# EAGLE design WallE 2.0 (EAGLE 7.2.0)
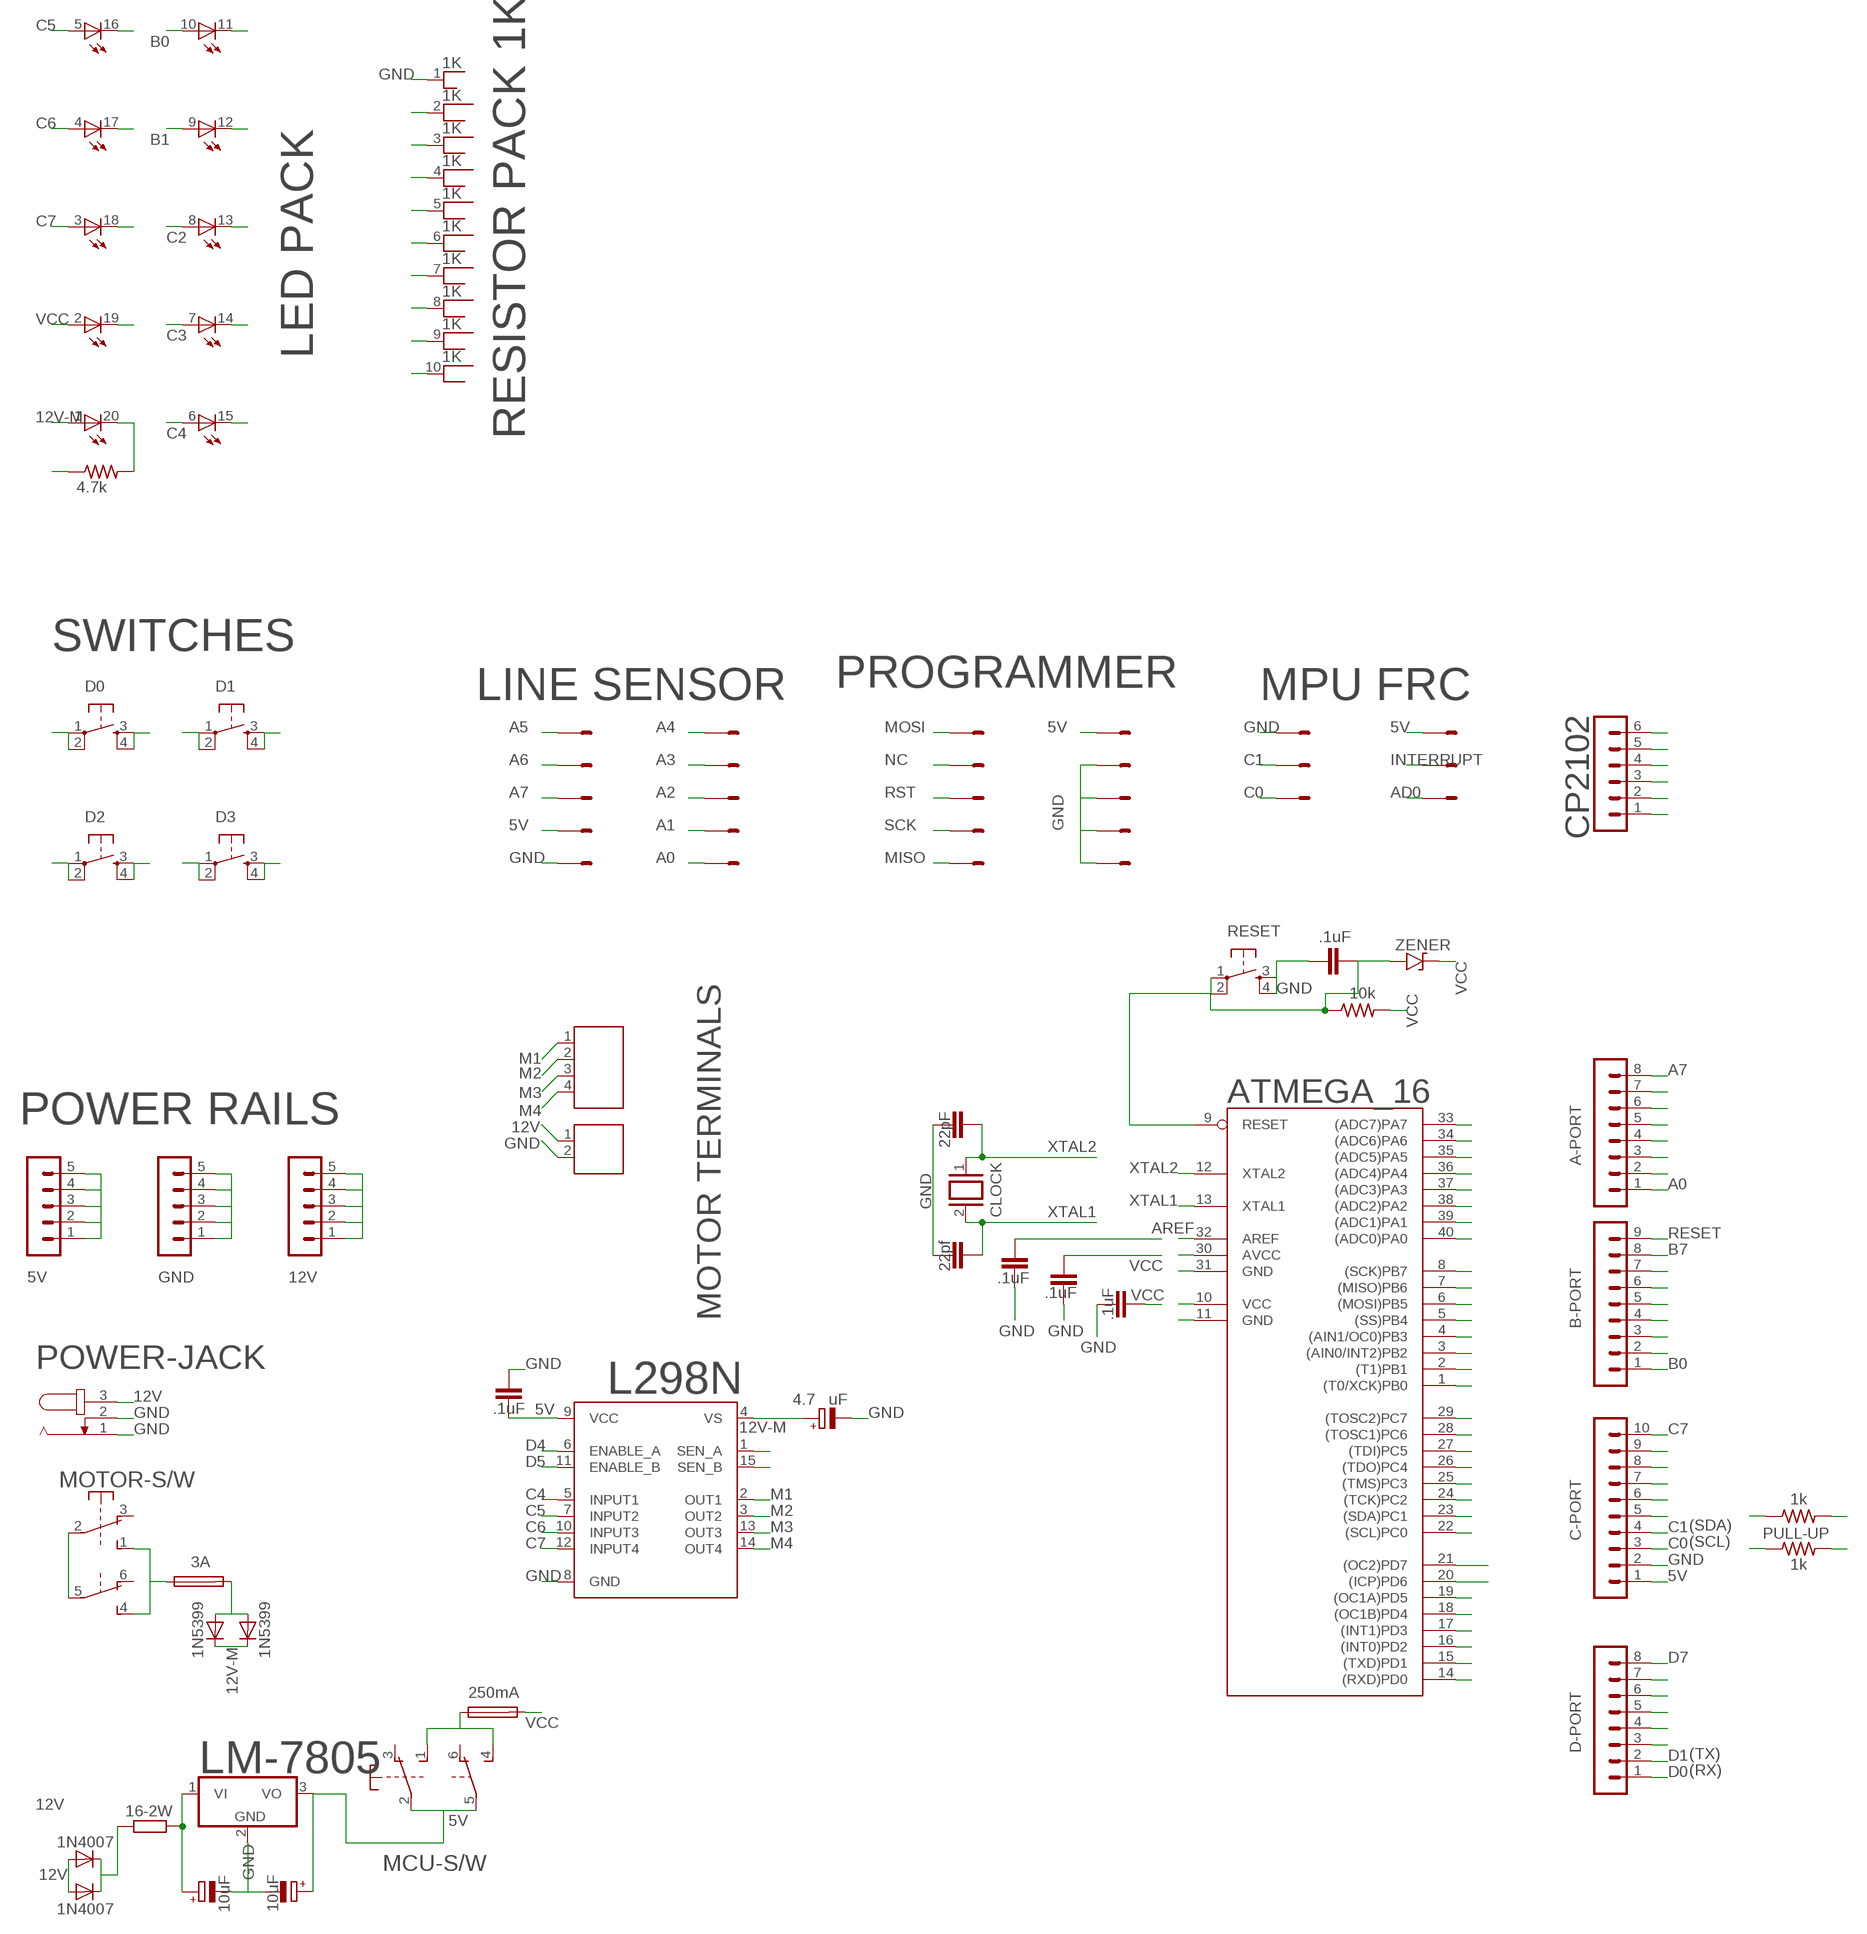
[diagram p0: schematic, sheet 1]

## Parts
5V  MA05-1  [MA05-1]
12V  MA05-1  [MA05-1]
16-2W  R-EU_0617/17  [0617/17]
A-PORT  MA08-1  [MA08-1]
ATMEGA_16  MEGA32-P  [DIL40]
B-PORT  MA09-1  [MA09-1]
C1  10uF  CPOL-EUE2.5-6  [E2,5-6]
C2  .1uF  C5/2.5  [C5B2.5]
C3  22pf  C2.5/2  [C2.5-2]
C4  22pF  C2.5/2  [C2.5-2]
C5  .1uF  C5/2.5  [C5B2.5]
C6  .1uF  C5/2.5  [C5B2.5]
C7  .1uF  C5/2.5  [C5B2.5]
C8  4.7 uF  CPOL-EUE2.5-6  [E2,5-6]
C9  .1uF  C5/2.5  [C5B2.5]
C10  10uF  CPOL-EUE2.5-6  [E2,5-6]
C-PORT  MA10-1  [MA10-1]
CLOCK  XTAL/S  [QS]
CP2102  MA06-1  [MA06-1]
D0  DTS-6  [DTS-6]
D1  DTS-6  [DTS-6]
D2  DTS-6  [DTS-6]
D3  DTS-6  [DTS-6]
D4  1N4007  DIODE-D-7.5  [D-7.5]
D5  1N4007  DIODE-D-7.5  [D-7.5]
D6  1N5399  DIODE-DO15-12  [DO15-12]
D7  1N5399  DIODE-DO15-12  [DO15-12]
D-PORT  MA08-1  [MA08-1]
DZ1  LB10  [LB10]
F1  3A  SH25  [SH25]
F2  250mA  SH25  [SH25]
GND  MA05-1  [MA05-1]
J1  691131710004  [691131710004]
J2  691131710002  [691131710002]
L298N  L298  [MULTIWATT-15]
LINE-SENSOR  057-010-1  [057-010-1]
LM-7805  786TV  [TO220V]
MCU-S/W  9077-2  [9077-2]
MOTOR-S/W  9077-2  [9077-2]
MPU-6050  057-006-1  [057-006-1]
POWER-JACK  JACK-PLUG1  [SPC4078]
R2  4.7k  R-US_0207/7  [0207/7]
R3  10k  R-US_0207/7  [0207/7]
R5  1k  R-US_0207/7  [0207/7]
R6  1k  R-US_0207/7  [0207/7]
RESET  DTS-6  [DTS-6]
RN1  1K  RNX9  [RN-10]
X2  PROGRAMMER  057-010-1  [057-010-1]
ZENER  ZENER  1N9ZENER2  [DO35-2]

## Nets
3.3V: CP2102.1
5V: 5V.1 5V.2 5V.3 5V.4 5V.5 C9.1 C10.+ C-PORT.1 CP2102.6 L298N.9(VCC) LINE-SENSOR.7 LM-7805.3(VO) MCU-S/W.2(1:P) MCU-S/W.5(2:P) MPU-6050.2 R5.2 R6.2 X2.2
12V: 12V.1 12V.2 12V.3 12V.4 12V.5 D4.A D5.A J2.1 MOTOR-S/W.2(1:P) MOTOR-S/W.5(2:P) POWER-JACK.3
12V-M: C8.+ D6.C D7.C DZ1.1(-1:A) L298N.4(VS)
A0: A-PORT.1 ATMEGA_16.40((ADC0)PA0) LINE-SENSOR.10
A1: A-PORT.2 ATMEGA_16.39((ADC1)PA1) LINE-SENSOR.8
A2: A-PORT.3 ATMEGA_16.38((ADC2)PA2) LINE-SENSOR.6
A3: A-PORT.4 ATMEGA_16.37((ADC3)PA3) LINE-SENSOR.4
A4: A-PORT.5 ATMEGA_16.36((ADC4)PA4) LINE-SENSOR.2
A5: A-PORT.6 ATMEGA_16.35((ADC5)PA5) LINE-SENSOR.1
A6: A-PORT.7 ATMEGA_16.34((ADC6)PA6) LINE-SENSOR.3
A7: A-PORT.8 ATMEGA_16.33((ADC7)PA7) LINE-SENSOR.5
AREF: ATMEGA_16.32(AREF) C7.1
B0: ATMEGA_16.1((T0/XCK)PB0) B-PORT.1 DZ1.10(-10:A)
B0R: DZ1.11(-10:C) RN1.10
B1: ATMEGA_16.2((T1)PB1) B-PORT.2 DZ1.9(-9:A)
B1R: DZ1.12(-9:C) RN1.9
B2: ATMEGA_16.3((AIN0/INT2)PB2) B-PORT.3
B3: ATMEGA_16.4((AIN1/OC0)PB3) B-PORT.4
B4: ATMEGA_16.5((SS)PB4) B-PORT.5
B5: ATMEGA_16.6((MOSI)PB5) B-PORT.6 X2.1
B6: ATMEGA_16.7((MISO)PB6) B-PORT.7 X2.9
B7: ATMEGA_16.8((SCK)PB7) B-PORT.8 X2.7
C0: ATMEGA_16.22((SCL)PC0) C-PORT.3 MPU-6050.5 R6.1
C1: ATMEGA_16.23((SDA)PC1) C-PORT.4 MPU-6050.3 R5.1
C2: ATMEGA_16.24((TCK)PC2) C-PORT.5 DZ1.8(-8:A)
C2R: DZ1.13(-8:C) RN1.8
C3: ATMEGA_16.25((TMS)PC3) C-PORT.6 DZ1.7(-7:A)
C3R: DZ1.14(-7:C) RN1.7
C4: ATMEGA_16.26((TDO)PC4) C-PORT.7 DZ1.6(-6:A) L298N.5(INPUT1)
C4R: DZ1.15(-6:C) RN1.6
C5: ATMEGA_16.27((TDI)PC5) C-PORT.8 DZ1.5(-5:A) L298N.7(INPUT2)
C5R: DZ1.16(-5:C) RN1.5
C6: ATMEGA_16.28((TOSC1)PC6) C-PORT.9 DZ1.4(-4:A) L298N.10(INPUT3)
C6R: DZ1.17(-4:C) RN1.4
C7: ATMEGA_16.29((TOSC2)PC7) C-PORT.10 DZ1.3(-3:A) L298N.12(INPUT4)
C7R: DZ1.18(-3:C) RN1.3
D0: ATMEGA_16.14((RXD)PD0) CP2102.3 D0.1 D0.2 D-PORT.1
D1: ATMEGA_16.15((TXD)PD1) CP2102.4 D1.1 D1.2 D-PORT.2
D2: ATMEGA_16.16((INT0)PD2) D2.1 D2.2 D-PORT.3
D3: ATMEGA_16.17((INT1)PD3) D3.1 D3.2 D-PORT.4
D4: ATMEGA_16.18((OC1B)PD4) D-PORT.5 L298N.6(ENABLE_A)
D5: ATMEGA_16.19((OC1A)PD5) D-PORT.6 L298N.11(ENABLE_B)
D6: ATMEGA_16.20((ICP)PD6) D-PORT.7
D7: ATMEGA_16.21((OC2)PD7) D-PORT.8
DTR: CP2102.2
GND: ATMEGA_16.11(GND) ATMEGA_16.31(GND) C1.- C2.2 C3.2 C4.2 C5.2 C6.2 C7.2 C8.- C9.2 C10.- C-PORT.2 CP2102.5 D0.3 D0.4 D1.3 D1.4 D2.3 D2.4 D3.3 D3.4 GND.1 GND.2 GND.3 GND.4 GND.5 J2.2 L298N.1(SEN_A) L298N.8(GND) L298N.15(SEN_B) LINE-SENSOR.9 LM-7805.2(GND) MPU-6050.1 MPU-6050.6 POWER-JACK.1 POWER-JACK.2 R2.1 RESET.3 RESET.4 RN1.1 X2.4 X2.6 X2.8 X2.10
INTERRUPT: MPU-6050.4
M1: J1.1 L298N.2(OUT1)
M2: J1.2 L298N.3(OUT2)
M3: J1.3 L298N.13(OUT3)
M4: J1.4 L298N.14(OUT4)
N$1: DZ1.20(-1:C) R2.2
N$2: 16-2W.2 C1.+ LM-7805.1(VI)
N$3: F1.1 MOTOR-S/W.1(1:S) MOTOR-S/W.4(2:S)
N$6: F2.1 MCU-S/W.1(1:S) MCU-S/W.4(2:S)
N$8: 16-2W.1 D4.C D5.C
N$9: D6.A D7.A F1.2
N$10: X2.3
RESET: ATMEGA_16.9(RESET) B-PORT.9 C5.1 R3.1 RESET.1 RESET.2 X2.5 ZENER.A
VCC: ATMEGA_16.10(VCC) ATMEGA_16.30(AVCC) C2.1 C6.1 DZ1.2(-2:A) F2.2 R3.2 ZENER.C
VCCR: DZ1.19(-2:C) RN1.2
XTAL1: ATMEGA_16.13(XTAL1) C3.1 CLOCK.2
XTAL2: ATMEGA_16.12(XTAL2) C4.1 CLOCK.1
Unconnected: MCU-S/W.3(1:O) MCU-S/W.6(2:O) MOTOR-S/W.3(1:O) MOTOR-S/W.6(2:O)

## Notes on the sheet
- LED PACK
- RESISTOR PACK 1K
- SWITCHES
- LINE SENSOR
- MPU FRC
- MOSI | 5V
- NC
- RST | AD0
- SCK | GND
- MISO
- POWER RAILS
- MOTOR TERMINALS
- (SDA)
- PULL-UP
- (SCL)
- (TX)
- (RX)

## Library data of the parts
5V 12V GND = con-lstb:MA05-1: PIN HEADER; OC_FARNELL: unknown; OC_NEWARK: unknown
16-2W = resistor:R-EU_: RESISTOR, European symbol
A-PORT D-PORT = con-lstb:MA08-1: PIN HEADER; OC_FARNELL: unknown; OC_NEWARK: unknown
ATMEGA_16 = atmel:MEGA32-P: MICROCONTROLLER 32 Kbytes FLASH 2 Kbytes SRAM 1 Kbytes EEPROM USART 8-channel 10 bit ADC Source: www.atmel.com .. doc2503.pdf; MPN: ATMEGA32-16PU; OC_FARNELL: 1661729; OC_NEWARK: 51P1794
B-PORT = con-lstb:MA09-1: PIN HEADER; OC_FARNELL: unknown; OC_NEWARK: unknown
C1 C8 C10 = rcl:CPOL-EU: POLARIZED CAPACITOR, European symbol
C2-C7 C9 = capacitor-wima:C: CAPACITOR naming: grid - package width
C-PORT = con-lstb:MA10-1: PIN HEADER; OC_FARNELL: unknown; OC_NEWARK: unknown
CLOCK = special:XTAL/S: CRYSTAL
CP2102 = con-lstb:MA06-1: PIN HEADER; OC_FARNELL: unknown; OC_NEWARK: unknown
D0 D1-D3 RESET = switch-tact:DTS-6
D4-D7 = diode:DIODE-: DIODE
DZ1 = led:LB10: LED BLOCK 10-LED bar graph, DIL, Siemens
F1 F2 = fuse:SH25: FUSE HOLDER grid 25 mm, OGN0031 8211, Schurter (Buerklin); MF: SCHURTER; MPN: 0031.8211; OC_FARNELL: 1162741; OC_NEWARK: 96B9380
J1 = Wurth_Elektronik_Electromechanic_Terminal_Blocks_Connectors_rev16b:691131710004: WR-TBL Terminal block - CUU5/4 - 4 Pins;=>Code : Con_TBL_Screw_PClamp_5.00_6911317100xx_691131710004 <http://katalog.we-online.de/media/images/eican/Con_TBL_Screw_PClamp_5.00_6911317100xx_pf2.jpg> Details see: http://katalog.we-online.de/em/datasheet/6911317100xx.pdf Created 11/3/2014, Karrer Zheng 2014 (C) Wurth Elektronik
J2 = Wurth_Elektronik_Electromechanic_Terminal_Blocks_Connectors_rev16b:691131710002: WR-TBL Terminal block - CUU5/2 CUU5/2GR - 2 Pins;=>Code : Con_TBL_Screw_PClamp_5.00_6911317100xx_691131710002 <http://katalog.we-online.de/media/images/eican/Con_TBL_Screw_PClamp_5.00_6911317100xx_pf2.jpg> Details see: http://katalog.we-online.de/em/datasheet/6911317100xx.pdf Created 11/23/2014, Karrer Zheng 2014 (C) Wurth Elektronik
L298N = st-microelectronics:L298: DUAL FULL-BRIDGE DRIVER; MPN: L298N; OC_FARNELL: 1589425; OC_NEWARK: 32M1527
LINE-SENSOR X2 = con-panduit:057-010-: CONNECTOR 10-pin series 057 contact pc board low profile headers; OC_FARNELL: unknown; OC_NEWARK: unknown
LM-7805 = linear:78*: Positive VOLTAGE REGULATOR Source: http://cache.national.com/ds/LM/LM78L05.pdf http://www.fairchildsemi.com/ds/LM/LM7805.pdf
MCU-S/W MOTOR-S/W = switch-misc:9077-2: MARQUARDT SWITCH 9077.0200 Distributor: Buerklin <https://www.buerklin.com/default.asp?event=ShowArtikel%2812G2822%29&l=d&jump=ArtNr_12G2822>
MPU-6050 = con-panduit:057-006-: CONNECTOR 6-pin series 057 contact pc board low profile headers; OC_FARNELL: unknown; OC_NEWARK: unknown
POWER-JACK = con-jack:JACK-PLUG: DC POWER JACK Power Jack, DC, Right Angle, Through Hole, Rated 5A at 16VDC, PC Terminals Distributor: Farnell (www.Farnell.de) Drawing: 84N1161.pdf / 84N1162.pdf Manufacturer: SPC Technology (www.spctechnology.com) Type: SPC4077 / SPC 4078; OC_FARNELL: unknown; OC_NEWARK: unknown
R2 R3 R5 R6 = resistor:R-US_: RESISTOR, American symbol
RN1 = resistor-net:RNX9: RESISTOR NETWORK; OC_FARNELL: unknown; OC_NEWARK: unknown
ZENER = gm-diodes:1N9*ZENER: 1N9???B Zener Diode DO-35 case 1N957B - 1N992B (6.8V to 200V)

## Net classes
0 default: clearance 0.205 mm

## Board
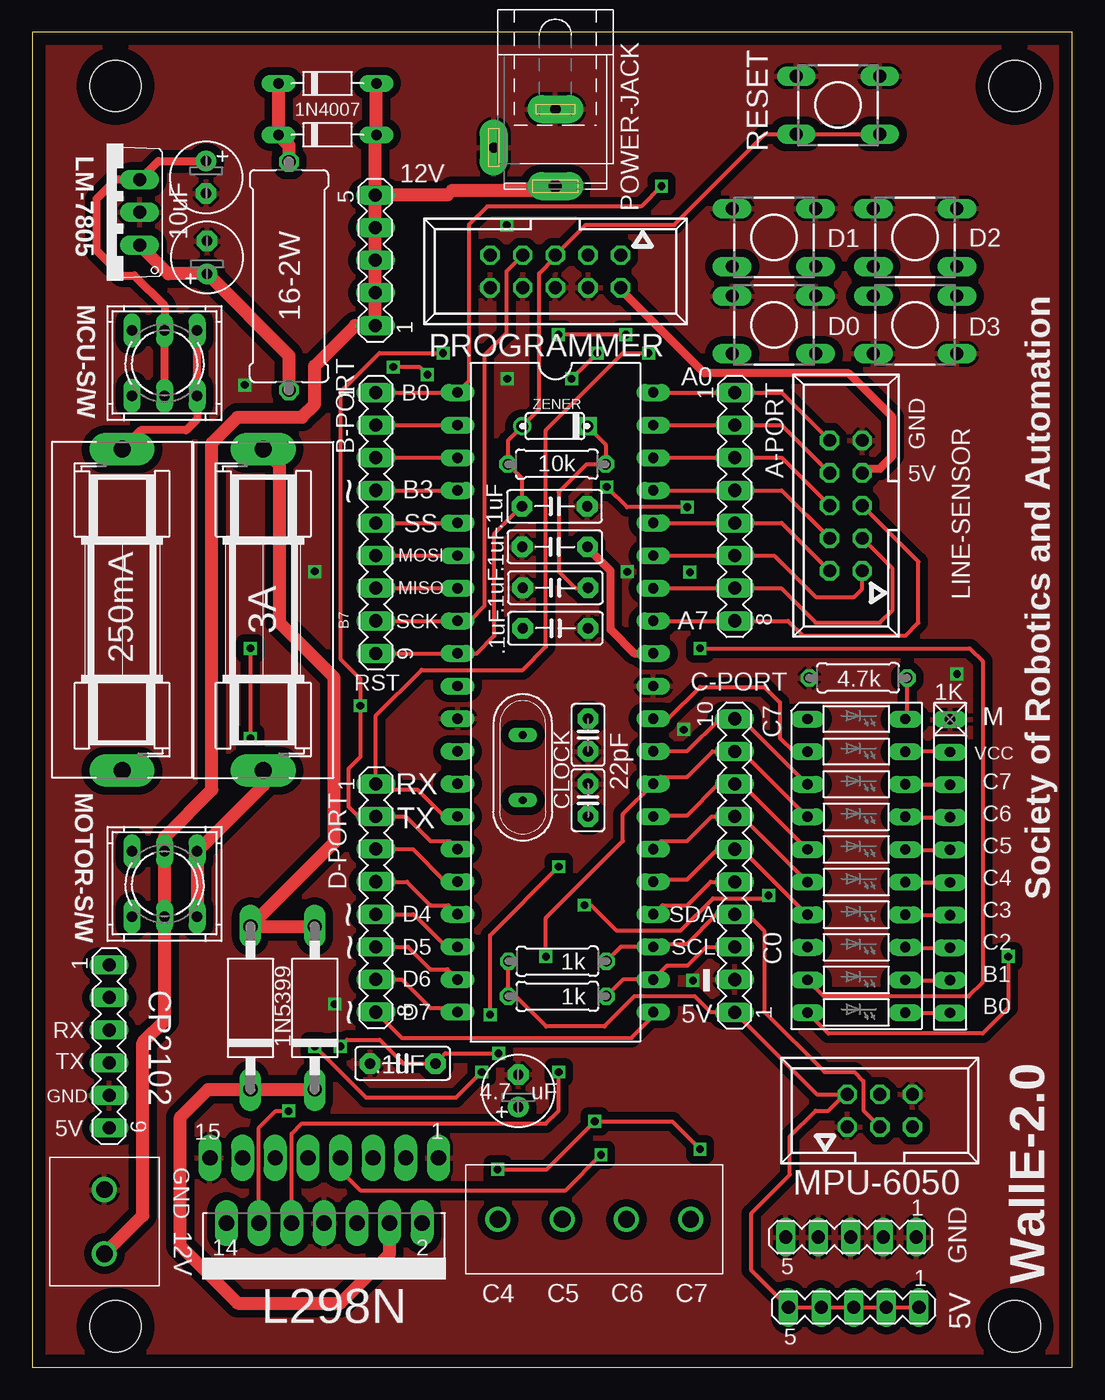
[diagram p1: board, top side]
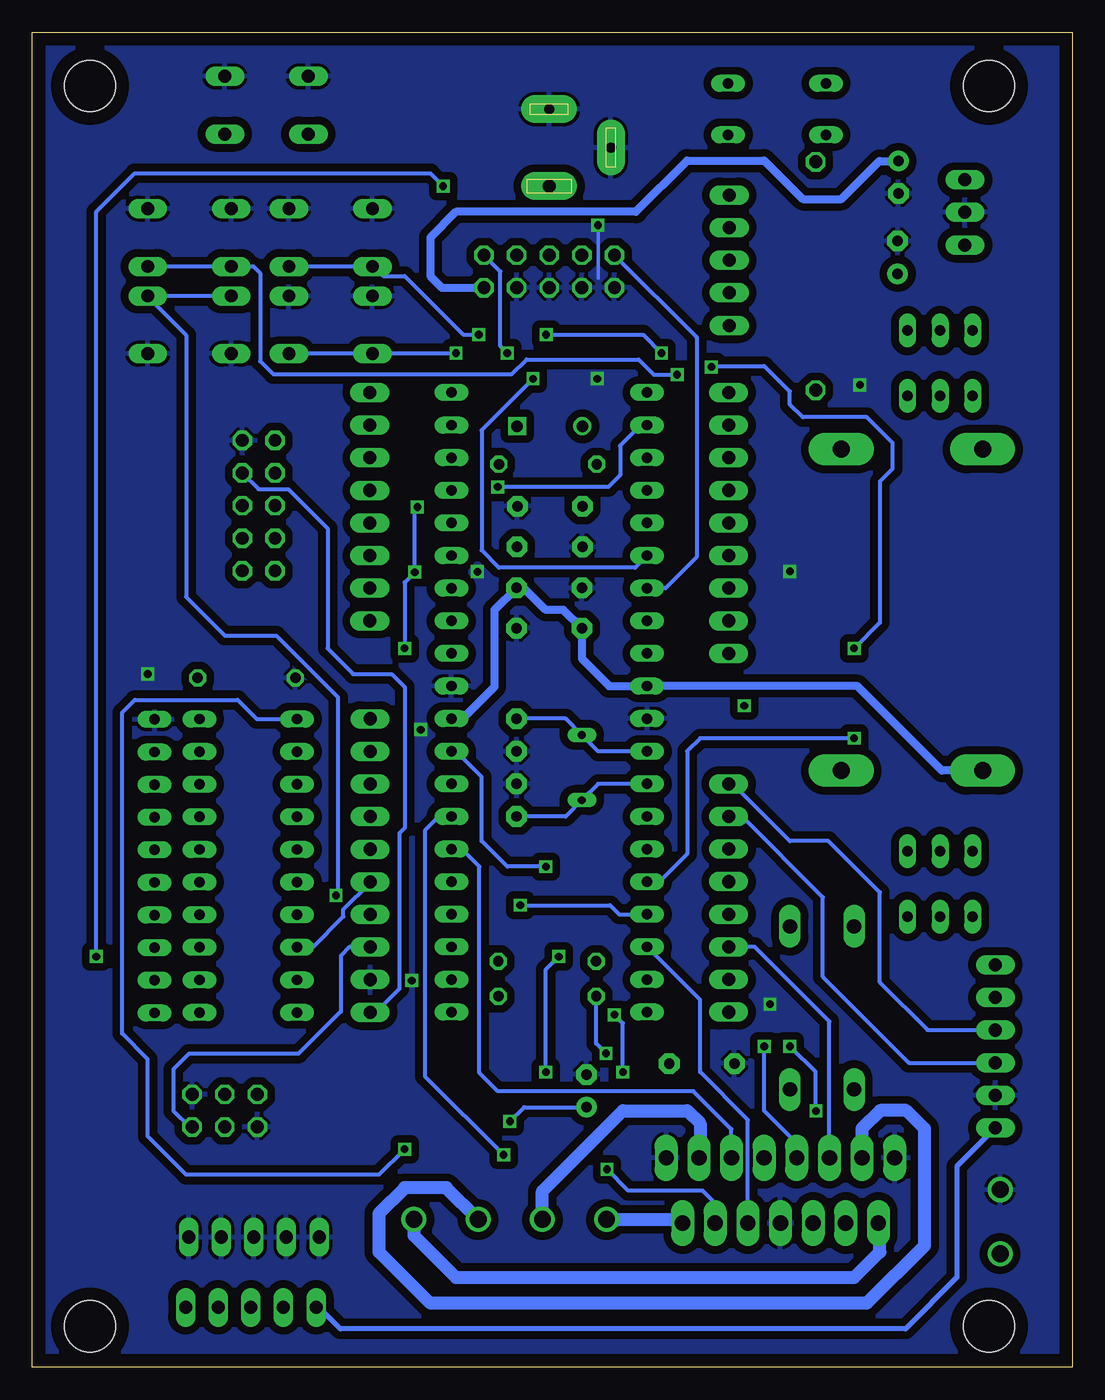
[diagram p2: board, bottom side, seen from below]

Size 81 x 104 mm. Coordinates in mm from the lower left corner, seen from the top.
Outline: 0,0 81,0 81,104 0,104 0,0
Copper layers (1*16): Top 0.035mm / dielectric 1.5mm / Bottom 0.035mm
Design rules "default *": minimum track width 10mil, minimum drill 24mil, track to track 9mil, track to pad 9mil, pad to pad 9mil, via to via 9mil, smd to smd 8mil, copper to edge 40mil, drill to drill 8mil, minimum pad ring 10mil, minimum via ring 8mil, stop-mask expansion 4mil, vias tented up to drill 0mil, thermal gap 10mil
Holes 4 mm at 6.5,3.2 6.5,99.8 76.5,99.8 76.5,3.2

### Footprints (pad centres in the part's own frame; a part is rotated, then mirrored left to right if it is on the bottom)
MA05-1 = drill 1.016 long: 1 -5.08,0; 2 -2.54,0; 3 0,0; 4 2.54,0; 5 5.08,0
0617/17 = drill 1.016 octagon: 1 -8.89,0; 2 8.89,0
MA08-1 = drill 1.016 long: 1 -8.89,0; 2 -6.35,0; 3 -3.81,0; 4 -1.27,0; 5 1.27,0; 6 3.81,0; 7 6.35,0; 8 8.89,0
DIL40 = drill 0.813 long: 1 -24.13,-7.62; 2 -21.59,-7.62; 3 -19.05,-7.62; 4 -16.51,-7.62; 5 -13.97,-7.62; 6 -11.43,-7.62; 7 -8.89,-7.62; 8 -6.35,-7.62; 9 -3.81,-7.62; 10 -1.27,-7.62; 11 1.27,-7.62; 12 3.81,-7.62; 13 6.35,-7.62; 14 8.89,-7.62; 15 11.43,-7.62; 16 13.97,-7.62; 17 16.51,-7.62; 18 19.05,-7.62; 19 21.59,-7.62; 20 24.13,-7.62; 21 24.13,7.62; 22 21.59,7.62; 23 19.05,7.62; 24 16.51,7.62; 25 13.97,7.62; 26 11.43,7.62; 27 8.89,7.62; 28 6.35,7.62; 29 3.81,7.62; 30 1.27,7.62; 31 -1.27,7.62; 32 -3.81,7.62; 33 -6.35,7.62; 34 -8.89,7.62; 35 -11.43,7.62; 36 -13.97,7.62; 37 -16.51,7.62; 38 -19.05,7.62; 39 -21.59,7.62; 40 -24.13,7.62
MA09-1 = drill 1.016 long: 1 -10.16,0; 2 -7.62,0; 3 -5.08,0; 4 -2.54,0; 5 0,0; 6 2.54,0; 7 5.08,0; 8 7.62,0; 9 10.16,0
E2,5-6 = drill 0.813 pad 1.6: + -1.27,0 | drill 0.813 pad 1.6 octagon: - 1.27,0
C5B2.5 = drill 0.813 pad 1.6 octagon: 1 -2.54,0; 2 2.54,0
C2.5-2 = drill 0.813 pad 1.6 octagon: 1 -1.27,0; 2 1.27,0
MA10-1 = drill 1.016 long: 1 -11.43,0; 2 -8.89,0; 3 -6.35,0; 4 -3.81,0; 5 -1.27,0; 6 1.27,0; 7 3.81,0; 8 6.35,0; 9 8.89,0; 10 11.43,0
QS = drill 0.61 long: 1 -2.54,0; 2 2.54,0
MA06-1 = drill 1.016 long: 1 -6.35,0; 2 -3.81,0; 3 -1.27,0; 4 1.27,0; 5 3.81,0; 6 6.35,0
DTS-6 = drill 1 long: 1 -3.25,2.25; 2 3.25,2.25; 3 -3.25,-2.25; 4 3.25,-2.25
D-7.5 = drill 0.813 long: A 3.81,0; C -3.81,0
DO15-12 = drill 1.118 long: A 6.35,0; C -6.35,0
LB10 = drill 0.813 long: 1 -11.43,-3.81; 2 -8.89,-3.81; 3 -6.35,-3.81; 4 -3.81,-3.81; 5 -1.27,-3.81; 6 1.27,-3.81; 7 3.81,-3.81; 8 6.35,-3.81; 9 8.89,-3.81; 10 11.43,-3.81; 11 11.43,3.81; 12 8.89,3.81; 13 6.35,3.81; 14 3.81,3.81; 15 1.27,3.81; 16 -1.27,3.81; 17 -3.81,3.81; 18 -6.35,3.81; 19 -8.89,3.81; 20 -11.43,3.81
SH25 = drill 1.321 pad 2.54 long: 1 -12.522,0; 2 12.522,0
691131710004 = drill 1.3: 1 -7.5,0; 2 -2.5,0; 3 2.5,0; 4 7.5,0
691131710002 = drill 1.3: 1 -2.5,0; 2 2.5,0
MULTIWATT-15 = drill 1.2 long: 1 -8.89,-7.62; 2 -7.62,-2.54; 3 -6.35,-7.62; 4 -5.08,-2.54; 5 -3.81,-7.62; 6 -2.54,-2.54; 7 -1.27,-7.62; 8 0,-2.54; 9 1.27,-7.62; 10 2.54,-2.54; 11 3.81,-7.62; 12 5.08,-2.54; 13 6.35,-7.62; 14 7.62,-2.54; 15 8.89,-7.62
057-010-1 = drill 1 octagon: 1 -5.08,-1.27; 2 -5.08,1.27; 3 -2.54,-1.27; 4 -2.54,1.27; 5 0,-1.27; 6 0,1.27; 7 2.54,-1.27; 8 2.54,1.27; 9 5.08,-1.27; 10 5.08,1.27
TO220V = drill 1.016 long: 1 -2.54,-2.54; 2 0,-2.54; 3 2.54,-2.54
9077-2 = drill 0.813 long: 1 -2.54,2.54; 2 0,2.54; 3 2.54,2.54; 4 -2.54,-2.54; 5 0,-2.54; 6 2.54,-2.54
057-006-1 = drill 1 octagon: 1 -2.54,-1.27; 2 -2.54,1.27; 3 0,-1.27; 4 0,1.27; 5 2.54,-1.27; 6 2.54,1.27
SPC4078 = drill 0.8 pad 2.184 long: 1 -3,0; 2 0,-4.8 | drill 1 pad 2.184 long: 3 3,0
0207/7 = drill 0.813 octagon: 1 -3.81,0; 2 3.81,0
RN-10 = drill 0.813 long: 1 -11.43,0; 2 -8.89,0; 3 -6.35,0; 4 -3.81,0; 5 -1.27,0; 6 1.27,0; 7 3.81,0; 8 6.35,0; 9 8.89,0; 10 11.43,0
DO35-2 = drill 0.9: A 2.54,0 | drill 0.9 square: C -2.54,0

### Placement (x,y rotation side)
5V  63.97,4.67 180 top
12V  26.72,86.23 90 top
16-2W  20,85 270 top
A-PORT  54.71,67.04 270 top
ATMEGA_16  40.74,51.8 270 top
B-PORT  26.77,65.77 270 top
C1  13.62,86.45 90 top
C2  40.74,57.57 0 top
C3  43.28,44.18 90 top
C4  43.28,49.26 270 top
C5  40.68,67.07 0 top
C6  40.74,60.72 180 top
C7  40.7,63.91 180 top
C8  37.85,21.54 90 top
C9  28.86,23.68 180 top
C10  13.55,92.69 270 top
C-PORT  54.69,39.09 90 top
CLOCK  38.2,46.72 270 top
CP2102  6,25 270 top
D0  57.75,81.2 180 top
D1  57.75,88 180 top
D2  68.75,88 180 top
D3  68.75,81.2 0 top
D4  23,96 0 top
D5  23,100 0 top
D6  17,28 90 top
D7  22,28 90 top
D-PORT  26.77,36.56 270 top
DZ1  64.17,39.07 270 top
F1  18,59 90 top
F2  7,59 270 top
GND  63.74,10.15 180 top
J1  43.77,11.53 0 top
J2  5.63,11.35 90 top
L298N  22.74,8.7 180 top
LINE-SENSOR  63.36,67.12 90 top
LM-7805  5.83,89.96 90 top
MCU-S/W  10.31,78.22 180 top
MOTOR-S/W  10.31,37.65 180 top
MPU-6050  66,20 0 top
POWER-JACK  40.74,95 270 top
R2  64.31,53.71 0 top
R3  40.85,70.35 0 top
R5  40.9,31.63 180 top
R6  40.89,28.9 180 top
RESET  62.74,98.31 180 top
RN1  71.47,39.04 270 top
X2  40.74,85.36 180 top
ZENER  40.7,73.31 180 top

### Tracks (layer width: path | path; a pad name or v marks a point on that pad's centre or on a via)
5V  (via drill 0.6)
  Top 0.305: 5V.1 5V.2 5V.3 5V.4 5V.5 56,7.56 56,12 59,15 59,18 61,20 62,20 63.27,21.27 MPU-6050.2 61.08,21.27 C-PORT.1 52.82,27.66 51.58,28.9 46.9,28.9 44.55,26.55 40.02,26.55 37.67,28.9 R6.2 R5.2 | v24,25 24.52,25.52 27.05,25.52 28.89,23.68 C9.1 32.18,24.46 v36.32,24.46
  Top 0.61: MCU-S/W.2 MCU-S/W.5 10.31,82.69 7.96,85.04 6.96,85.04 5,87 5,91 6.5,92.5 LM-7805.3 9.83,93.96 C10.+ | LINE-SENSOR.7 64.97,70 66,70 67,71 67,74 63.57,77.43 52.34,77.43 45.82,83.95 X2.2
  Bottom 0.305: LINE-SENSOR.7 63.36,68.39 61.05,68.39 58,65.34 58,56 56,54 53,54 52,53 52,42 52.41,41.59 52.41,29.49 54.24,27.66 C-PORT.1 53.34,27.66 | L298N.9 21.47,17.47 24,20 v24,25 | v36.32,24.46 37.08,25.22 R6.2
  Bottom 0.406: 5V.5 58.67,4.67 57,3 13,3 9,7 9,15.65 CP2102.6
  Bottom 0.61: X2.2 49.09,84.09 50,85 50,88 48,90 34,90 30,94 24,94 21,91 18,91 15.04,93.96 C10.+
12V
  Top 1.016: 12V.1 12V.2 12V.3 12V.4 12V.5 | 12V.5 26.72,95.91 D4.A D5.A | 26.15,81.15 12V.1 | 12V.1 25.15,81.15 22,78 22,75 21,74 16,74 14,72 14,45 10.31,41.31 MOTOR-S/W.5 MOTOR-S/W.2 10.31,27 8.62,25.31 8.62,11.84 J2.1 | POWER-JACK.3 40.39,91.65 32.68,91.65 32.34,91.31 12V.5
12V-M  (via drill 0.6)
  Top 0.305: v52,17 49.84,19.16 v43.8,19.16 40.06,15.42 v36.24,15.42
  Top 1.016: D7.C D6.C 13.71,21.65 11.54,19.48 11.54,9.46 16,5 24,5 27.82,8.82 L298N.4
  Bottom 0.305: DZ1.1 63.5,50.5 65,52 73,52 74,51 74,26 72,24 72,18 69,15 54,15 v52,17 | L298N.4 27.82,12.79 28.79,13.76 34.58,13.76 v36.24,15.42 | v43.8,19.16 42.69,20.27 C8.+
A0
  Top 0.305: ATMEGA_16.40 A-PORT.1 58.36,75.93 LINE-SENSOR.10
A1
  Top 0.305: ATMEGA_16.39 A-PORT.2 58.36,73.39 LINE-SENSOR.8
A2
  Top 0.305: ATMEGA_16.38 A-PORT.3 58.36,70.85 LINE-SENSOR.6
A3
  Top 0.305: ATMEGA_16.37 A-PORT.4 58.36,68.31 LINE-SENSOR.4
A4
  Top 0.305: ATMEGA_16.36 A-PORT.5 58.36,65.77 LINE-SENSOR.2
A5
  Top 0.305: ATMEGA_16.35 A-PORT.6 57.77,63.23 61,60 64,60 64.63,60.63 LINE-SENSOR.1
A6
  Top 0.305: ATMEGA_16.34 A-PORT.7 58.31,60.69 61,58 66,58 67,59 67,62.21 LINE-SENSOR.3
A7
  Top 0.305: ATMEGA_16.33 A-PORT.8 58.85,58.15 60,57 68,57 69,58 69,62.75 LINE-SENSOR.5
AREF
  Top 0.61: ATMEGA_16.32 46.9,55.61 45.05,57.46 45.05,62.04 43.24,63.85 C7.1
B0  (via drill 0.6)
  Top 0.305: B-PORT.1 ATMEGA_16.1 34,76.81 34,89 35.42,90.42 47.42,90.42 v49,92 | v76,32 76,28 74,26 62,26 DZ1.10
  Bottom 0.305: v49,92 50,93 73,93 76,90 v76,32
B0R
  Top 0.305: DZ1.11 68.01,27.61 RN1.10
B1  (via drill 0.6)
  Top 0.305: B-PORT.2 ATMEGA_16.2 | v52,56 73,56 74,55 74,30 72.89,28.89 61.65,28.89 DZ1.9 | v51,67 46.32,67 v44.74,68.58
  Bottom 0.305: v52,56 52,61.14 v51.21,61.93 51.21,66.79 v51,67 | ATMEGA_16.2 33.61,73.39 35.22,71.78 35.22,69.5 36.14,68.58 v44.74,68.58
B1R
  Top 0.305: DZ1.12 68.01,30.15 RN1.9
B2
  Top 0.305: B-PORT.3 ATMEGA_16.3
B3
  Top 0.305: B-PORT.4 ATMEGA_16.4
B4
  Top 0.305: B-PORT.5 ATMEGA_16.5
B5  (via drill 0.6)
  Top 0.305: B-PORT.6 ATMEGA_16.6 | v42,77 v44,79
  Bottom 0.305: ATMEGA_16.6 34.06,62.29 44.65,62.29 46,63.64 46,73 v42,77 | X2.1 44.55,85.36 44.55,79.55 v44,79
B6
  Top 0.305: B-PORT.7 ATMEGA_16.7
  Bottom 0.305: X2.9 29.26,80.23 29.26,63.1 31.67,60.69 ATMEGA_16.7
B7
  Top 0.305: B-PORT.8 ATMEGA_16.8 34.06,58.15 35.22,59.31 35.22,78.84 36.93,80.55 36.93,85.36 X2.7
C0
  Top 0.305: C-PORT.3 52.47,32.74 51.03,31.3 49.45,31.3 ATMEGA_16.22 46.01,30.21 R6.1
  Bottom 0.305: C-PORT.3 56.29,32.74 56.97,32.06 56.97,27.72 60.26,24.43 68.8,24.43 70,23.23 70,20 68.73,18.73 MPU-6050.5
C1
  Top 0.305: MPU-6050.3 66,18.75 64.72,20.03 64.72,22.28 64,23 61.7,23 57,27.7 57,34 55.72,35.28 C-PORT.4 53.28,35.28 51,33 48.61,33 ATMEGA_16.23 45.83,32.75 R5.1
C2
  Top 0.305: ATMEGA_16.24 49.07,36 51,36 52.82,37.82 C-PORT.5
  Bottom 0.305: DZ1.8 59.16,32.72 56.77,35.11 56.77,35.67 54.69,37.75 C-PORT.5
C2R
  Top 0.305: DZ1.13 68.01,32.69 RN1.8
C3
  Top 0.305: ATMEGA_16.25 48.53,38 51,38 53.36,40.36 C-PORT.6 55.26,40.36 DZ1.7
C3R
  Top 0.305: DZ1.14 68.01,35.23 RN1.7
C4
  Top 0.305: ATMEGA_16.26 48.99,41 51,41 52.9,42.9 C-PORT.7 55.26,42.9 DZ1.6
  Bottom 0.305: ATMEGA_16.26 47.54,40.37 46.18,39.01 46.18,22.95 44.74,21.51 29.51,21.51 26.55,18.55 L298N.5
C4R
  Top 0.305: DZ1.15 68.01,37.77 RN1.6
C5  (via drill 0.6)
  Top 0.305: ATMEGA_16.27 48.45,43 51,43 53.44,45.44 C-PORT.8 55.26,45.44 DZ1.5 | v44.29,16.55 41.5,13.76 25.6,13.76 24.01,15.35 L298N.7
  Bottom 0.305: ATMEGA_16.27 49.33,42.91 50.42,41.82 50.42,22.68 v44.29,16.55
C5R
  Top 0.305: DZ1.16 68.01,40.31 RN1.5
C6  (via drill 0.6)
  Top 0.305: DZ1.4 55.26,47.98 C-PORT.9 52.98,47.98 51,46 48.91,46 ATMEGA_16.28 46,43.09 46,41 40,35 v40,32 | L298N.10 20.2,18.2 21,19 40,19 41,20 v41,23
  Bottom 0.305: v41,23 41,31 v40,32
C6R
  Top 0.305: DZ1.17 68.01,42.85 RN1.4
C7  (via drill 0.6)
  Top 0.305: ATMEGA_16.29 51,48 53.52,50.52 C-PORT.10 55.26,50.52 DZ1.3 | v35.66,27.47 35.66,33.66 v41,39 | L298N.12 17.66,18.66 18.97,19.97 v19.97,19.97 | v35,23 33,21 26,21 v22,25
  Bottom 0.305: v41,39 44,39 46,41 46,46 48,48 ATMEGA_16.29 | v35,23 35,26.81 v35.66,27.47 | v19.97,19.97 20,20 20,23 v22,25
C7R
  Top 0.305: DZ1.18 68.01,45.39 RN1.3
D0  (via drill 0.6)
  Top 0.305: ATMEGA_16.14 32.09,42.91 30,45 27.22,45 D-PORT.1 26.77,50.77 30.33,54.33 38.2,54.33 40,56.13 40,73 46,79 v48,79
  Bottom 0.305: D-PORT.1 26.45,45.45 22,41 19,41 15,37 15,30 11.27,26.27 CP2102.3 | v48,79 54.45,79 D0.2 D0.1
D1  (via drill 0.6)
  Top 0.305: ATMEGA_16.15 32.49,41 31,41 29.09,42.91 D-PORT.2 25.39,42.91 24.62,43.68 24.62,46.62 25.55,47.55 v25.55,51.53 25.55,53.63 24,55.18 24,75.96 27.04,79 v32,79 | v46.23,80.44 v40.99,80.44 v40.98,80.43
  Bottom 0.305: D-PORT.2 25.72,42.91 19.43,36.62 19.43,30.43 12.73,23.73 CP2102.4 | v46.23,80.44 47.44,80.44 52,85 53.65,85 54.4,85.75 D1.2 D1.1 | v40.98,80.43 33.43,80.43 v32,79
D2  (via drill 0.6)
  Top 0.305: D-PORT.3 29.63,40.37 32.17,37.83 ATMEGA_16.16 | v30.78,77.32 30.18,77.92 v28.11,77.92 | v17,56 v17,49
  Bottom 0.305: v30.78,77.32 32.59,77.32 33.78,78.51 42.5,78.51 43.66,77.35 62.22,77.35 63.24,78.37 63.24,85.23 63.76,85.75 D2.2 D2.1 | v28.11,77.92 28.03,78 24,78 22,76 22,75 21,74 16,74 14,72 14,70 15,69 15,58 v17,56 | v17,49 29,49 30,48 30,40 32.17,37.83 ATMEGA_16.16
D3  (via drill 0.6)
  Top 0.305: D-PORT.4 29.17,37.83 31,36 32.41,36 ATMEGA_16.17 | v43,36 43.53,36 45.53,34 50.48,34 53.02,36.54 57.12,36.54 v57.34,36.76
  Bottom 0.305: v43,36 36,36 35.29,35.29 ATMEGA_16.17 | D3.1 D3.2 72,83.38 69,80.38 69,60 66,57 62,57 57.18,52.18 57.18,36.92 v57.34,36.76
D4
  Top 0.305: D-PORT.5 29.71,35.29 32.25,32.75 ATMEGA_16.18
  Bottom 0.305: L298N.6 25.28,19.28 29,23 29,28.63 ATMEGA_16.18
D5
  Top 0.305: D-PORT.6 29.25,32.75 31,31 32.33,31 ATMEGA_16.19
  Bottom 0.305: L298N.11 18.93,26.93 24.75,32.75 D-PORT.6
D6
  Top 0.305: D-PORT.7 28.79,30.21 31,28 32.79,28 ATMEGA_16.20
D7
  Top 0.305: D-PORT.8 28.79,25.65 46.65,25.65 48.36,27.36 ATMEGA_16.21
GND  (via drill 0.6)
  Bottom 0.254: v36.95,88.96 36.92,88.96 36.92,84.85
  other vias: 46.33,61.97 50.74,49.67 16.55,76.52 37,77 22,62 51.45,30.13 23.55,28.29 72,54
  pour Top (isolate 0.6): 0,103.33 80.02,103.33 80.02,0 0,0
  pour Bottom (isolate 0.6): 0,103.33 80.02,103.33 80.02,0 0,0
M1
  Bottom 1.016: J1.1 30.65,11.53 L298N.2
M2
  Bottom 1.016: J1.2 41.27,13.73 35,20 30,20 29,19 29,16.41 L298N.3
M3
  Bottom 1.016: J1.3 48.74,14 52,14 54,12 54,9 50,5 16,5 11.52,9.48 11.52,18.58 12.96,20.02 14.98,20.02 16.39,18.61 L298N.13
M4
  Bottom 1.016: J1.4 51.27,10.27 48,7 17,7 15,9 15,11.12 L298N.14
N$1
  Top 0.305: DZ1.20 68.12,50.64 R2.2
N$2
  Top 1.016: LM-7805.1 10.61,85.18 C1.+ 20,78.8 16-2W.2
N$3
  Top 1.016: MOTOR-S/W.1 MOTOR-S/W.4 18,45.34 F1.1
N$6
  Top 0.61: MCU-S/W.4 MCU-S/W.1 12.85,73.85 12,73 8.48,73 F2.1
N$8
  Top 1.016: D5.C D4.C 20,95.19 16-2W.1
N$9
  Top 1.016: D7.A D6.A 23.52,40.87 23.52,53.72 19.24,58 19.24,70.28 F1.2
RESET
  Top 0.305: C5.1 38.1,67.11 | RESET.1 RESET.2 57.06,96.06 50,89 43.11,89 X2.5 40.74,86.47 39.47,85.2 39.47,74.62 ZENER.A 37.04,72.19 R3.1 38.14,69.25 C5.1 | C5.1 36,64.93 36,57 34.61,55.61 ATMEGA_16.9 B-PORT.9
VCC
  Top 0.305: ATMEGA_16.30 49.53,50.53 52,53 57,53 58.21,51.79 58.21,49.04 59.29,47.96 DZ1.2 | C6.1 42.28,60.72 41,62 41,68.18 43.17,70.35 R3.2 44.66,71.89 ZENER.C
  Bottom 0.61: ATMEGA_16.30 47.47,50.53 45,53 45,59 C6.1 42.72,60.72 41,59 39.63,59 C2.1 38.2,55.2 36.07,53.07 ATMEGA_16.10 16.75,53.07 10.16,46.48 F2.2
VCCR
  Top 0.305: RN1.2 71.44,47.96 DZ1.19
XTAL1
  Bottom 0.305: ATMEGA_16.13 36.93,45.45 CLOCK.2 39.47,42.91 C3.1
XTAL2
  Bottom 0.305: ATMEGA_16.12 36.93,47.99 CLOCK.1 39.47,50.53 C4.1

### Text on the board
tNames: A0 | B0 | ZENER | GND | 5V | B3 | ~ | SS | MOSI | MISO | B7 | SCK | A7 | RST | M | C7 | VCC | RX | C7 | TX | C6 | C5 | C4 | Society of Robotics and Automation | D4 | SDA | C3 | ~ | ~ | D5 | SCL | C2 | - | C0 | D6 | B1 | B0 | ~ | D7 | 5V | RX | TX | GND | 5V | GND | 12V | WallE-2.0 | C4 | C5 | C6 | C7